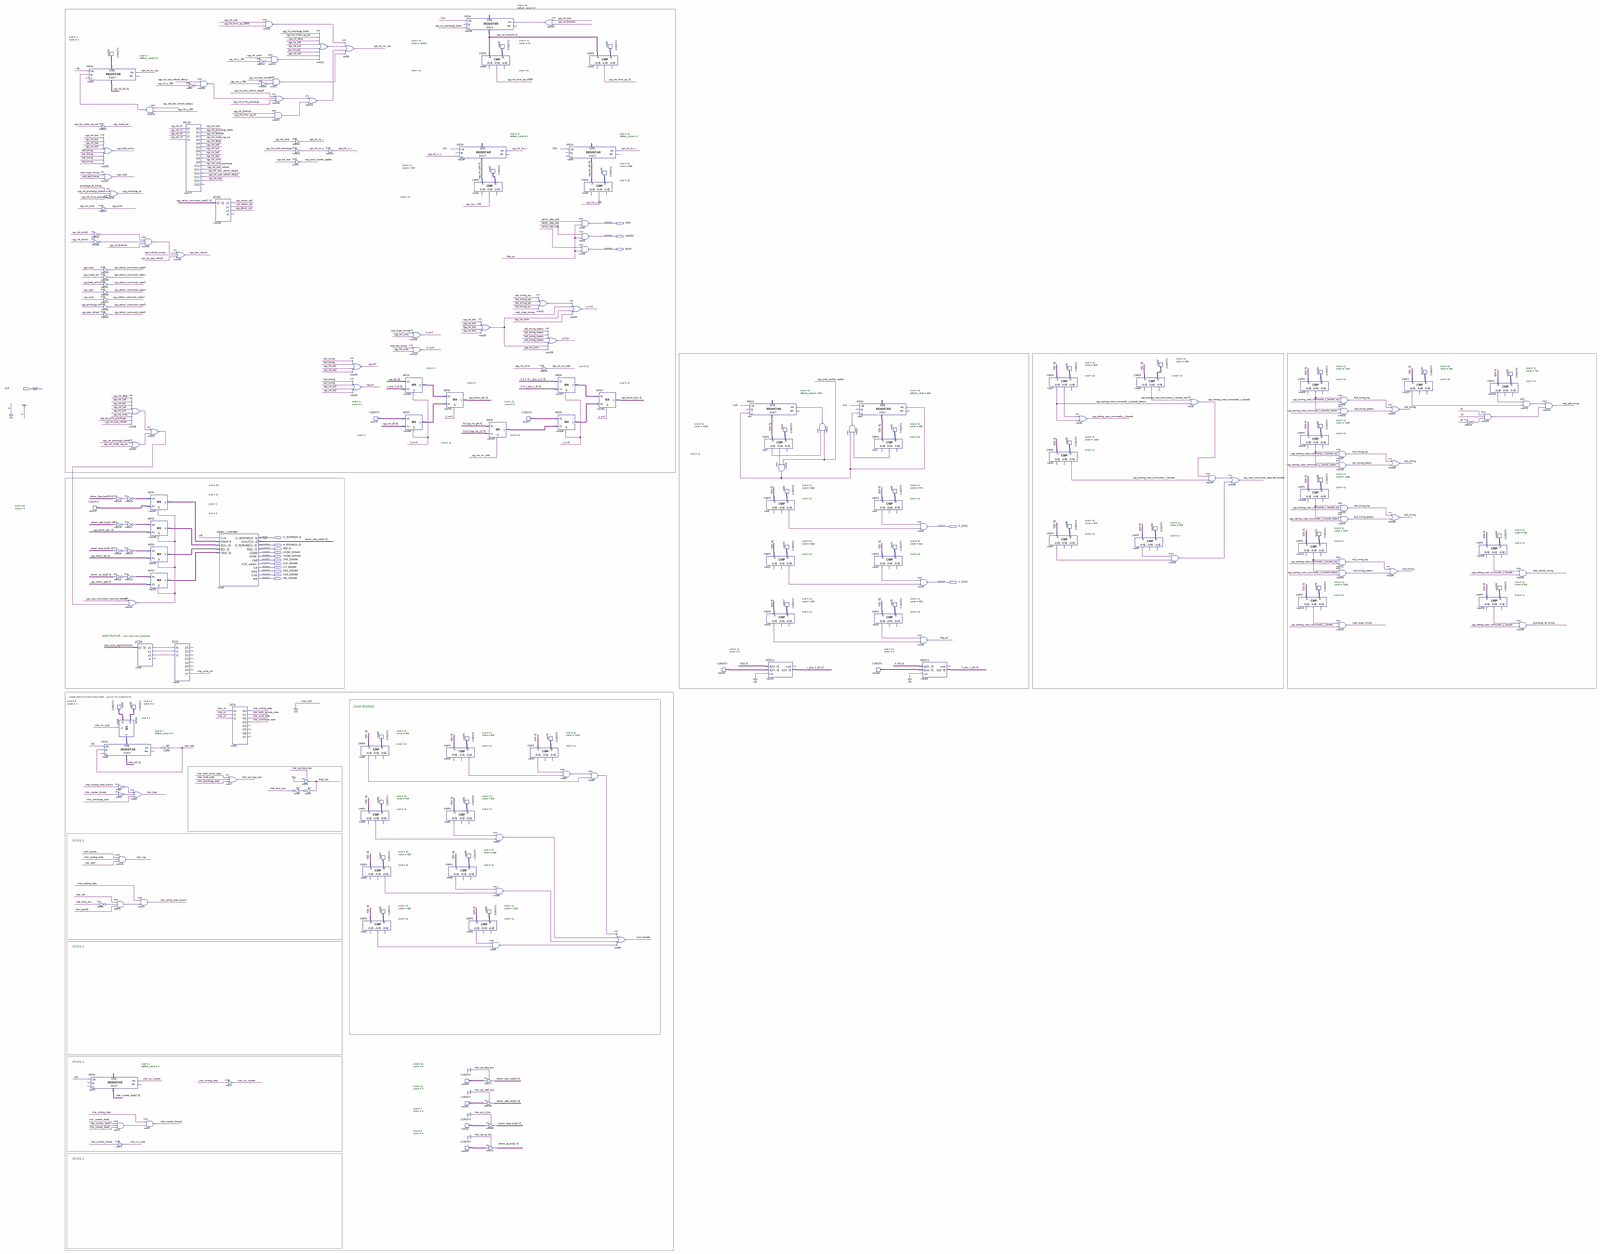
[diagram p0: schematic sheet, whole]
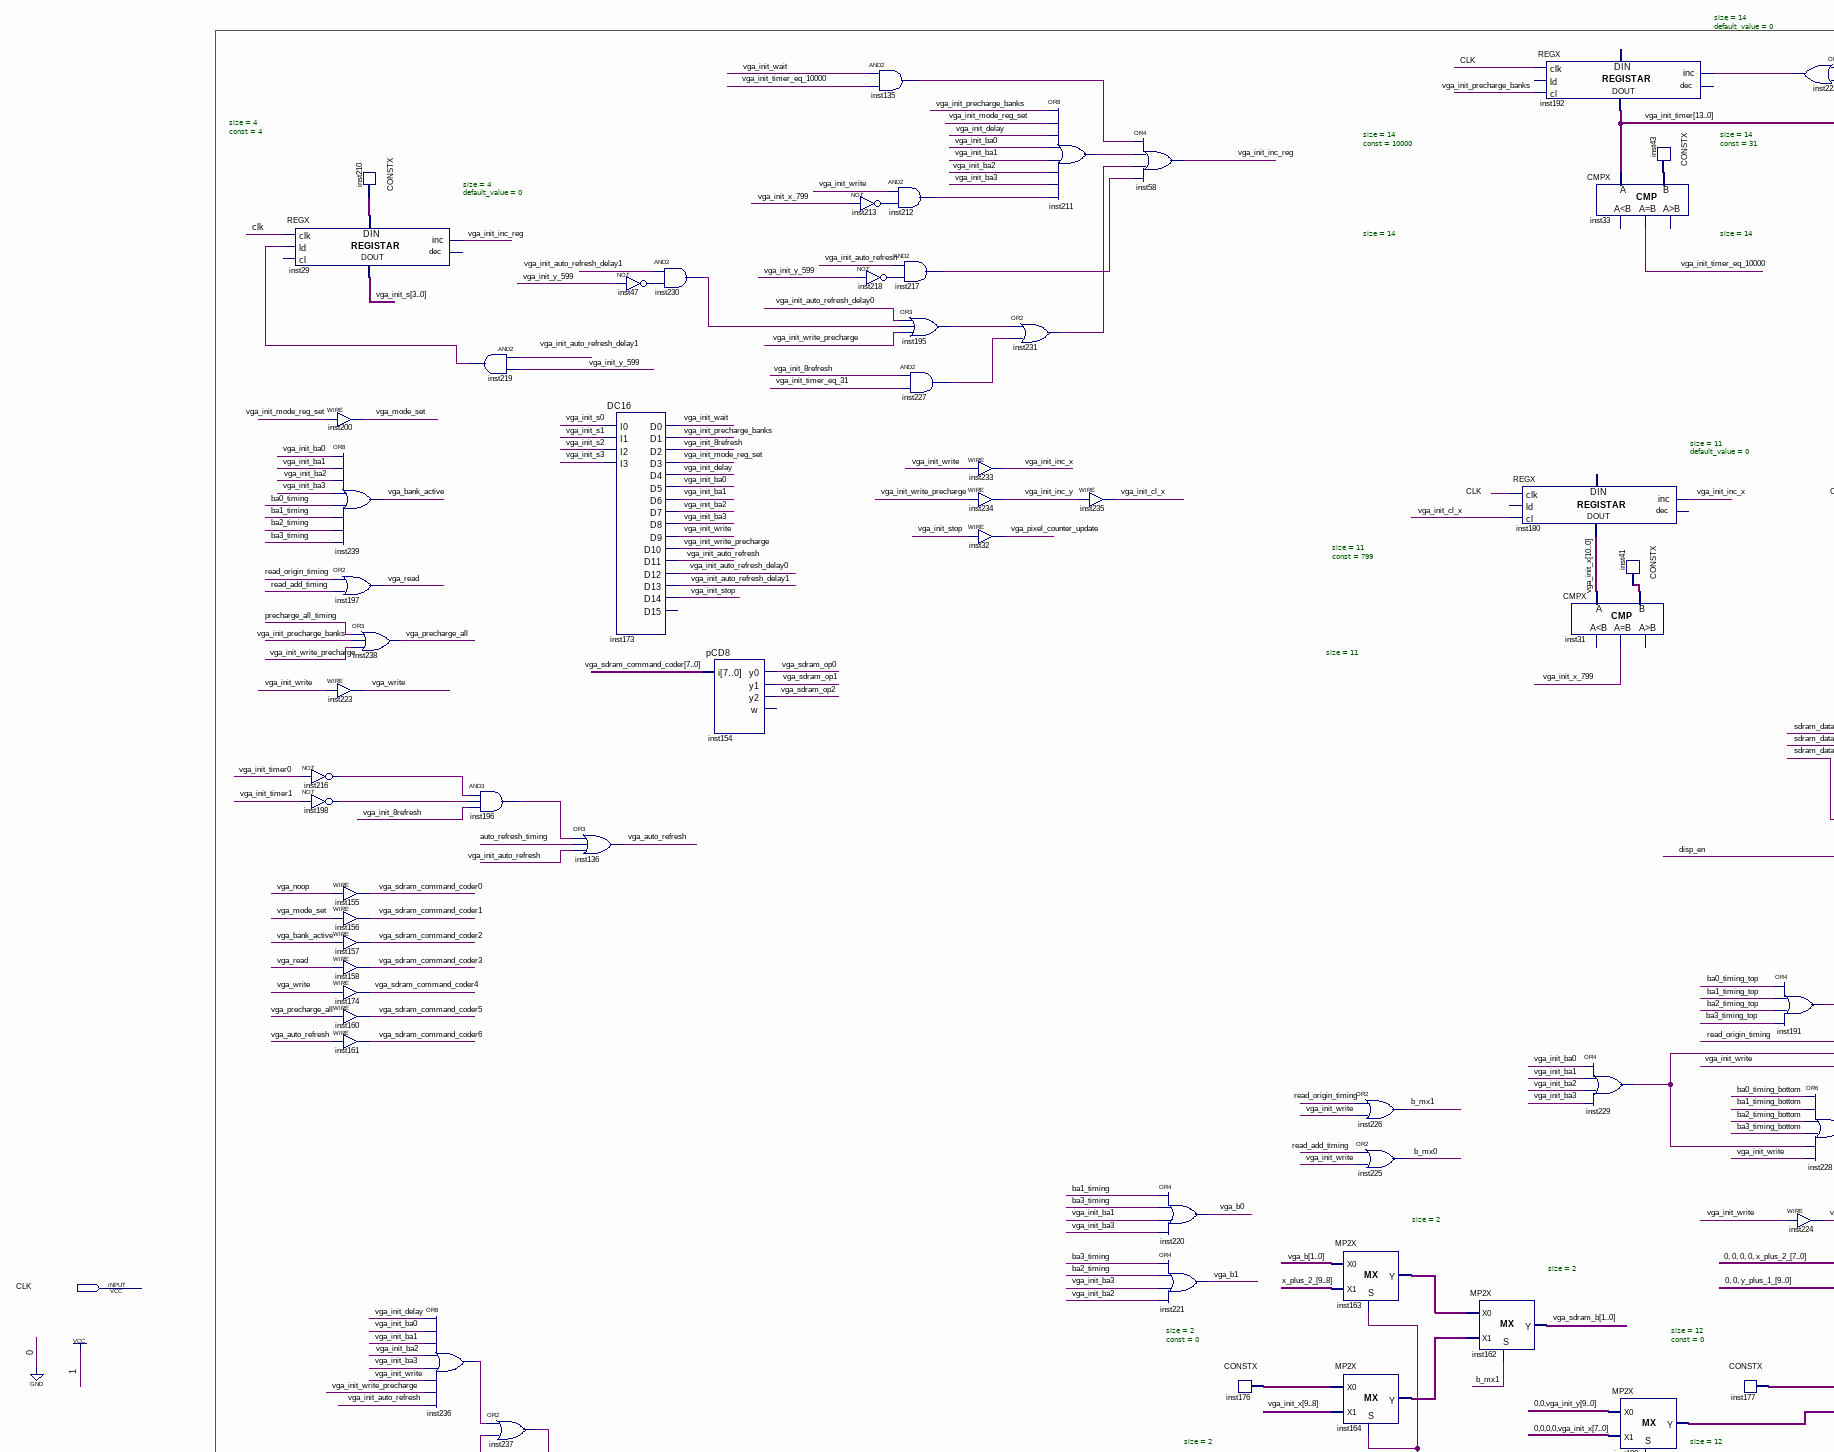
[diagram p1: schematic sheet, upper left part]
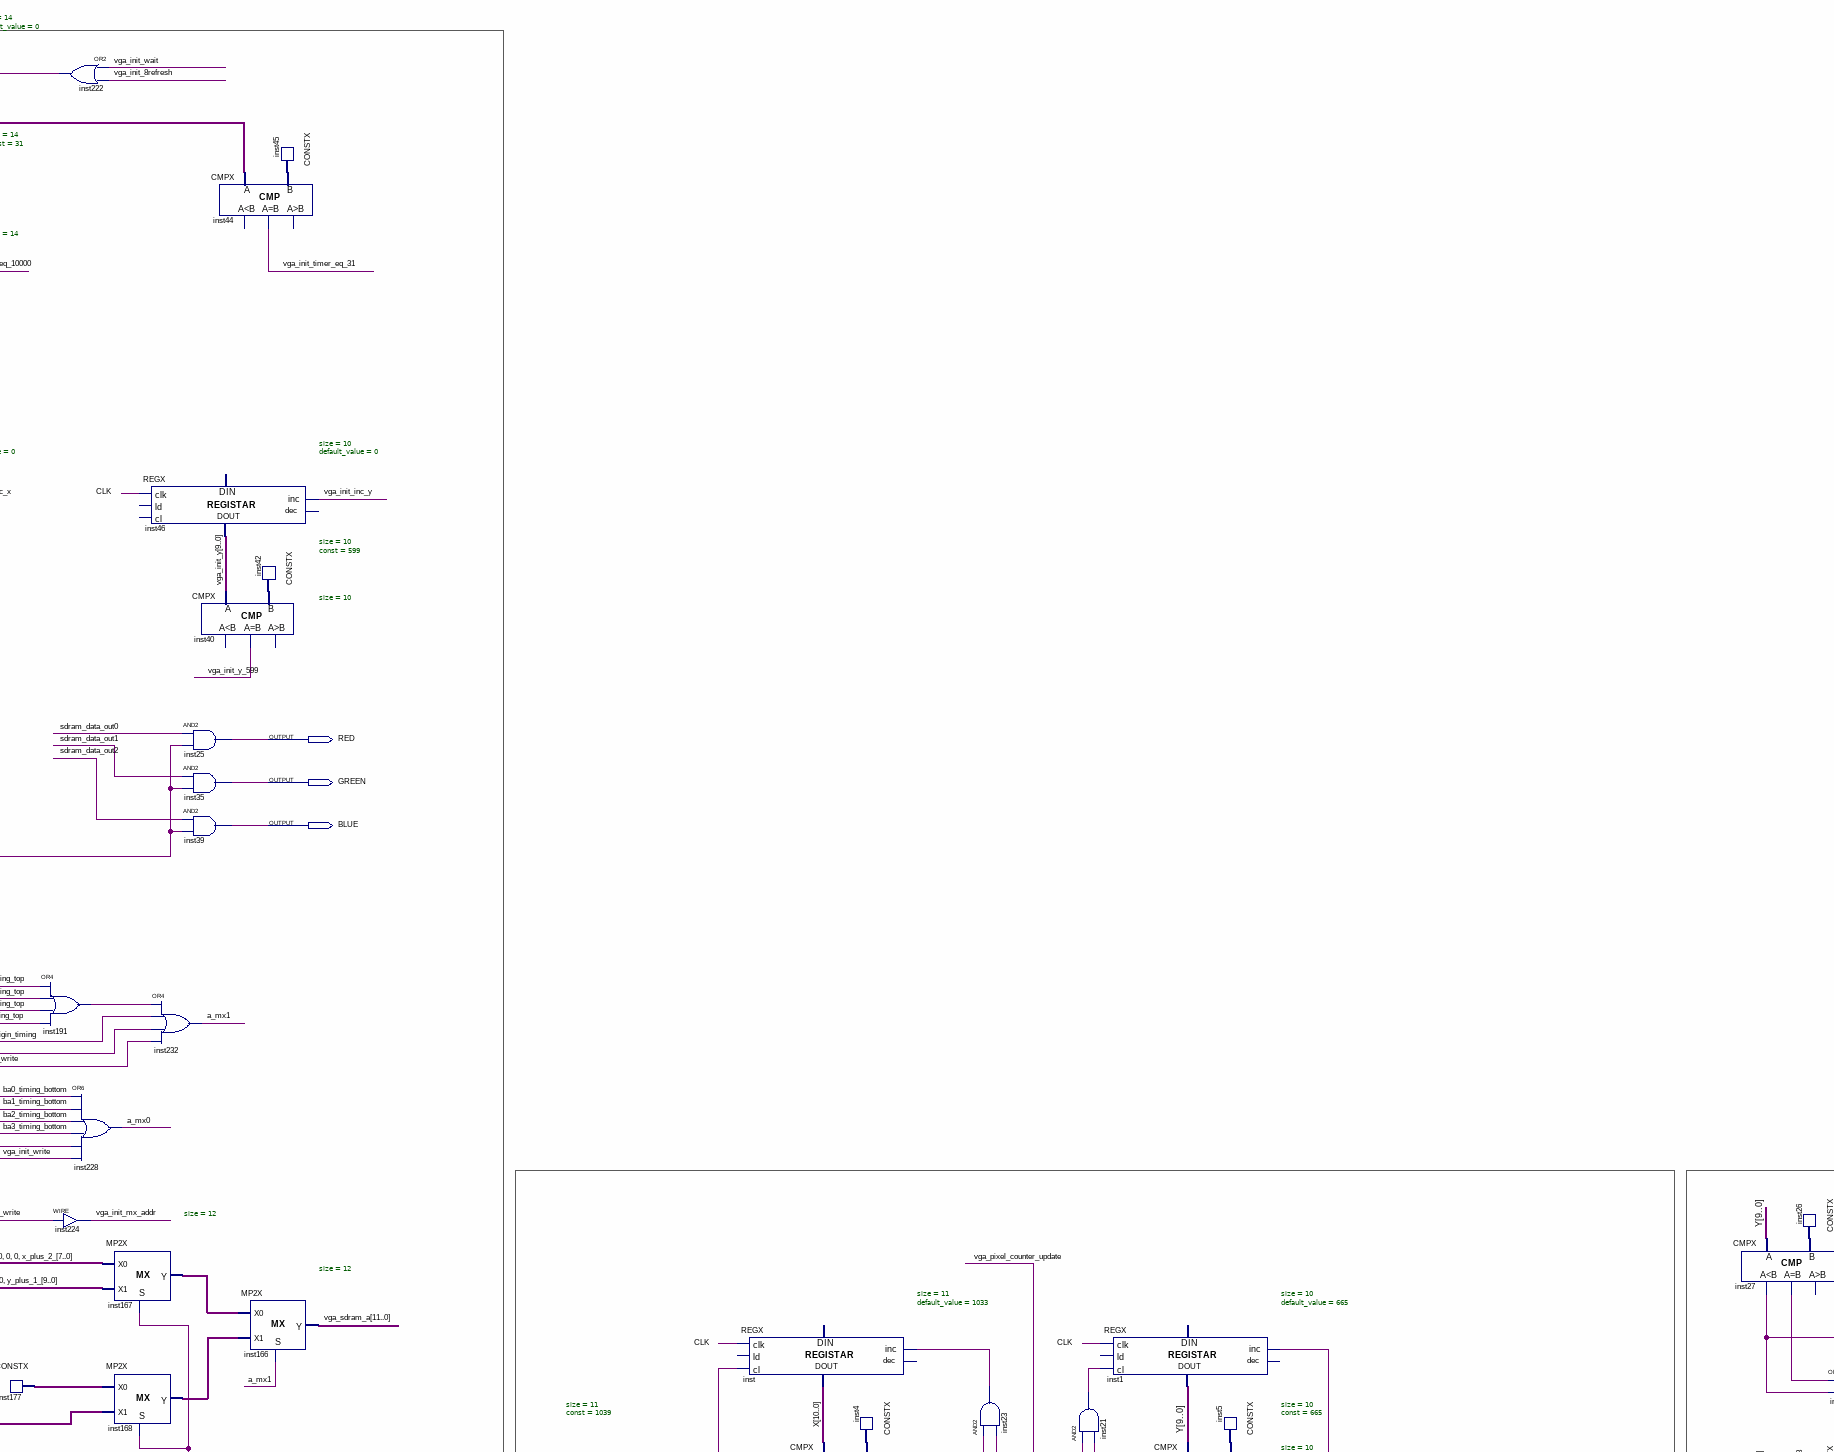
[diagram p2: schematic sheet, upper centre part]
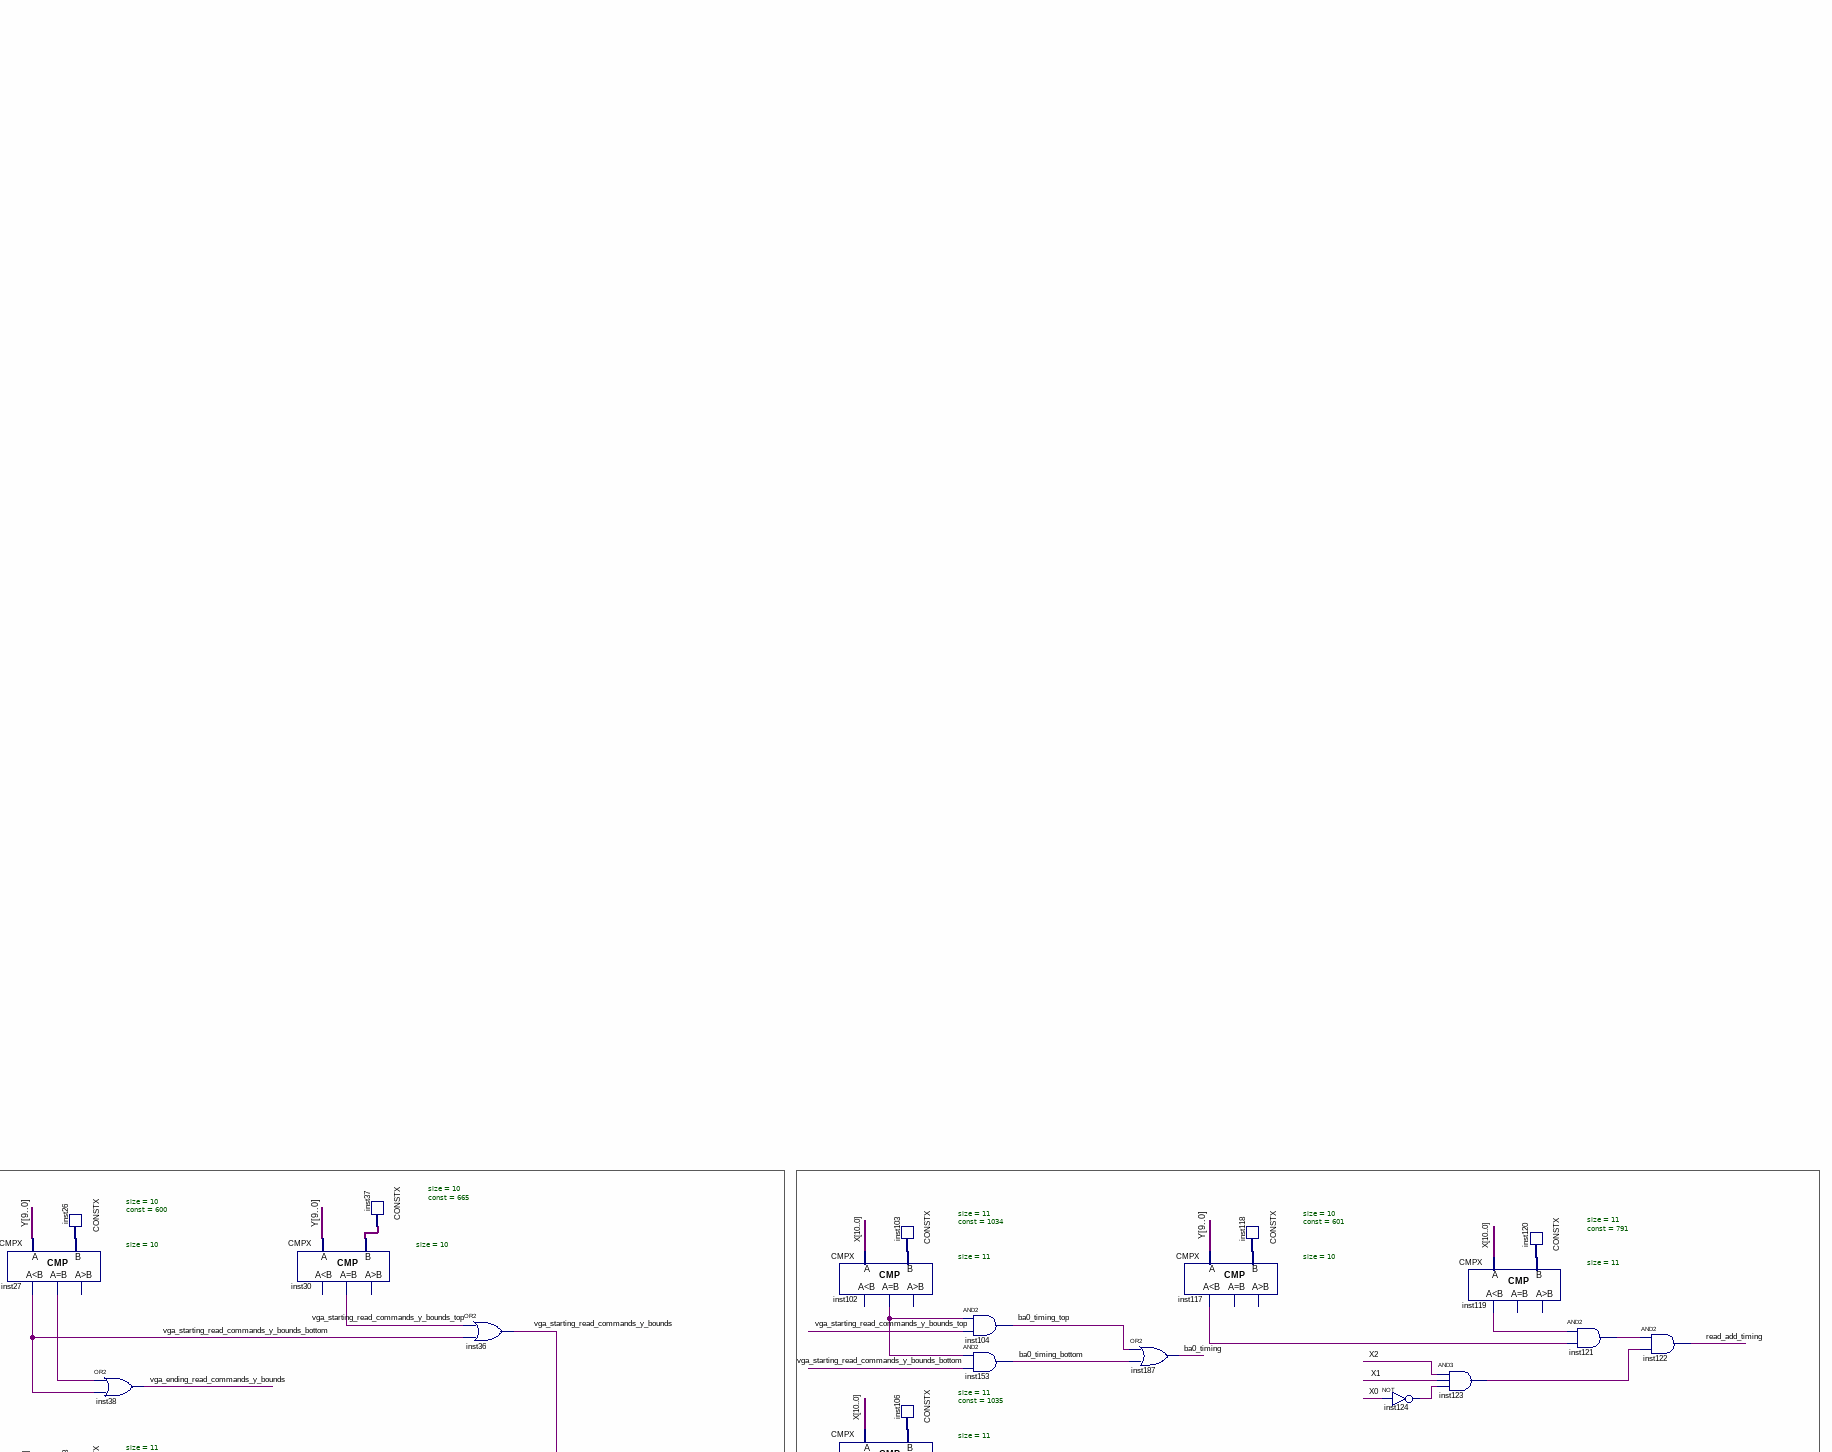
[diagram p3: schematic sheet, upper right part]
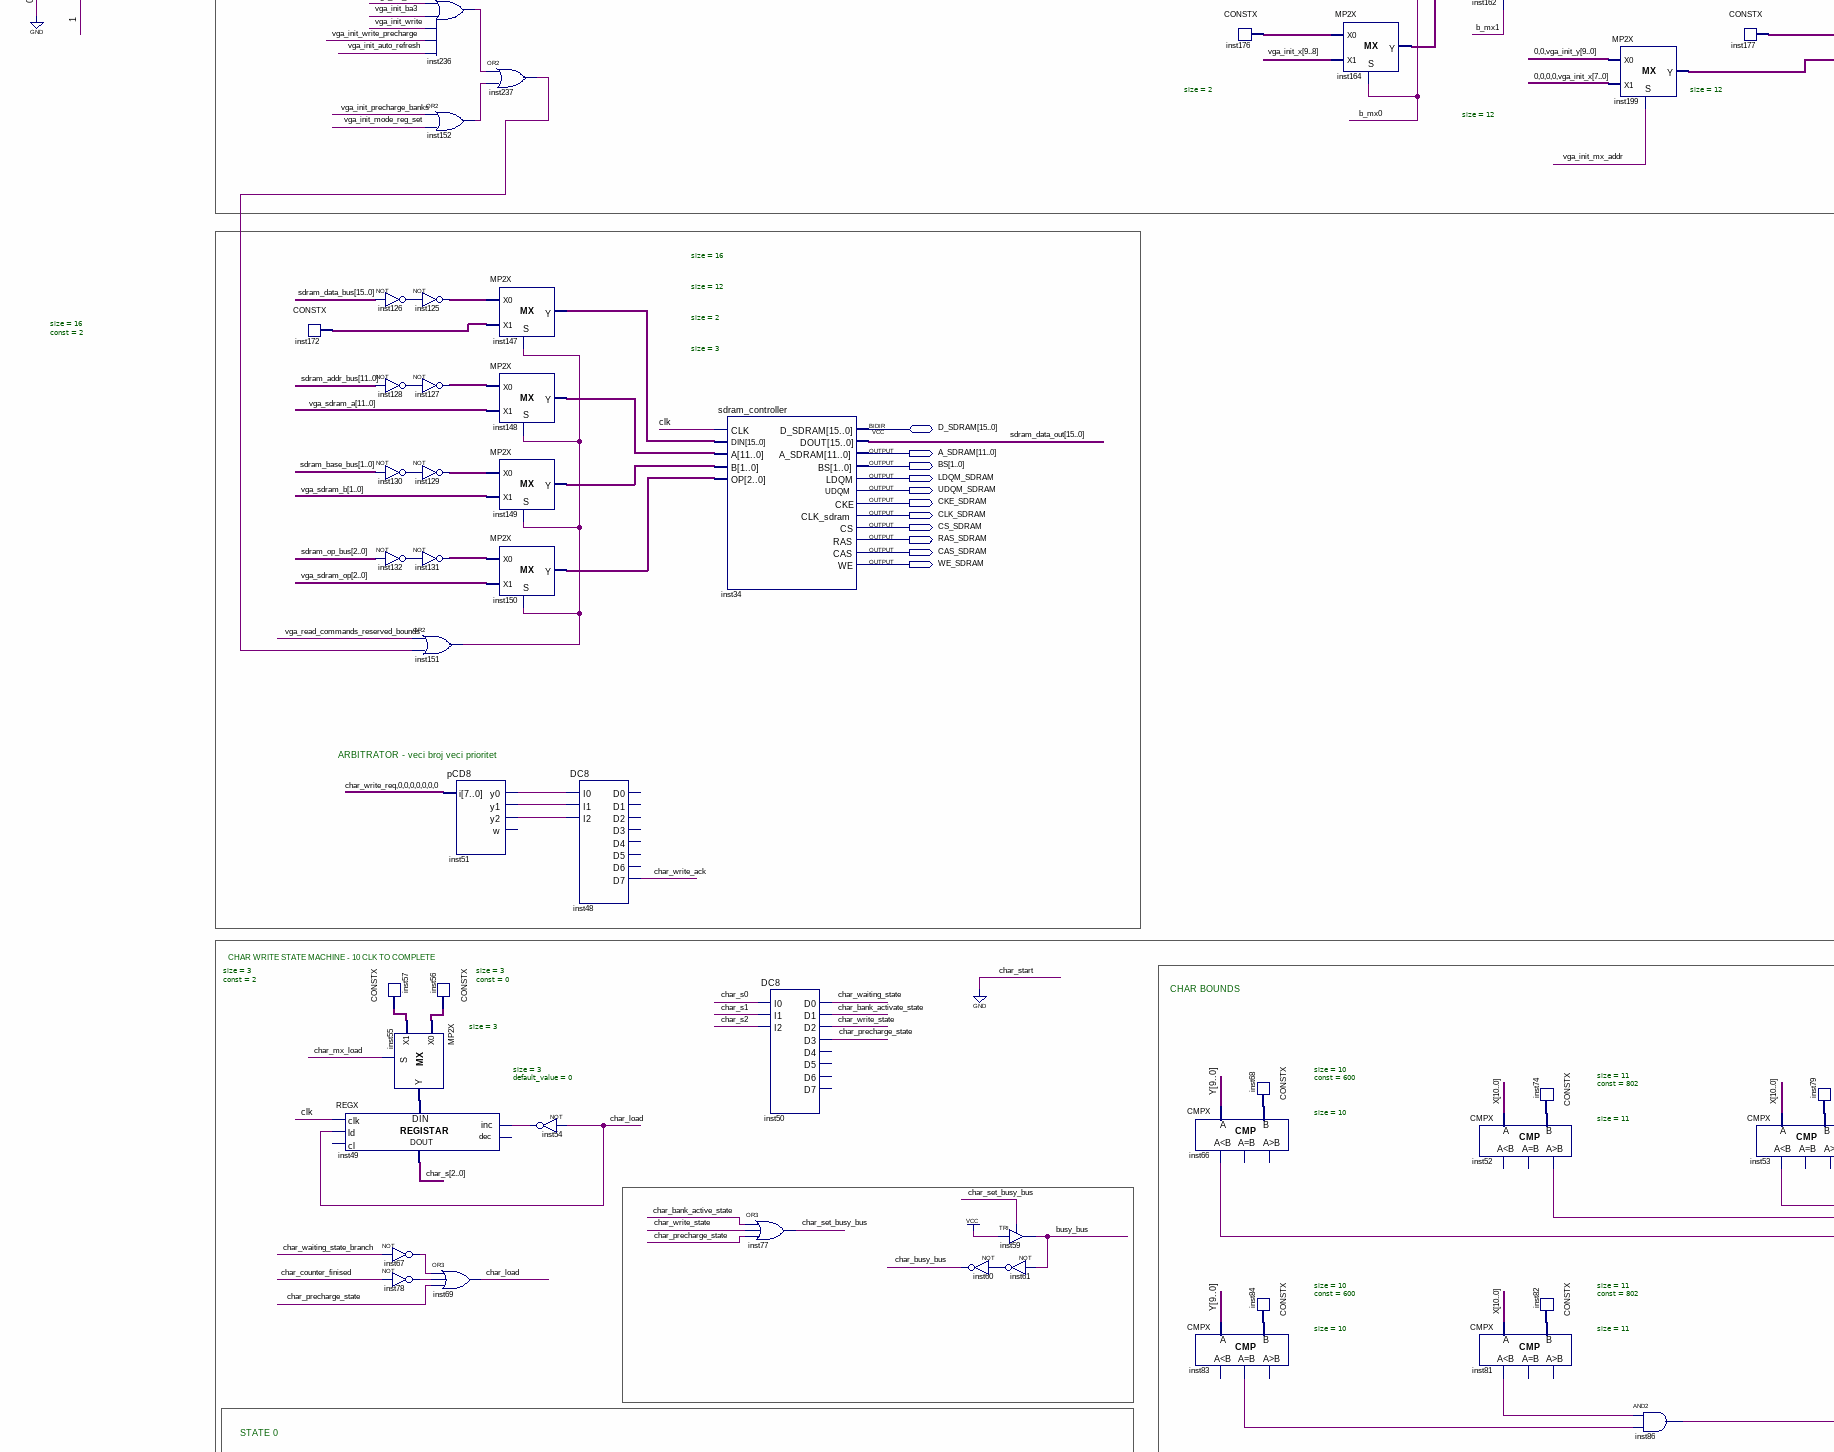
[diagram p4: schematic sheet, middle left part]
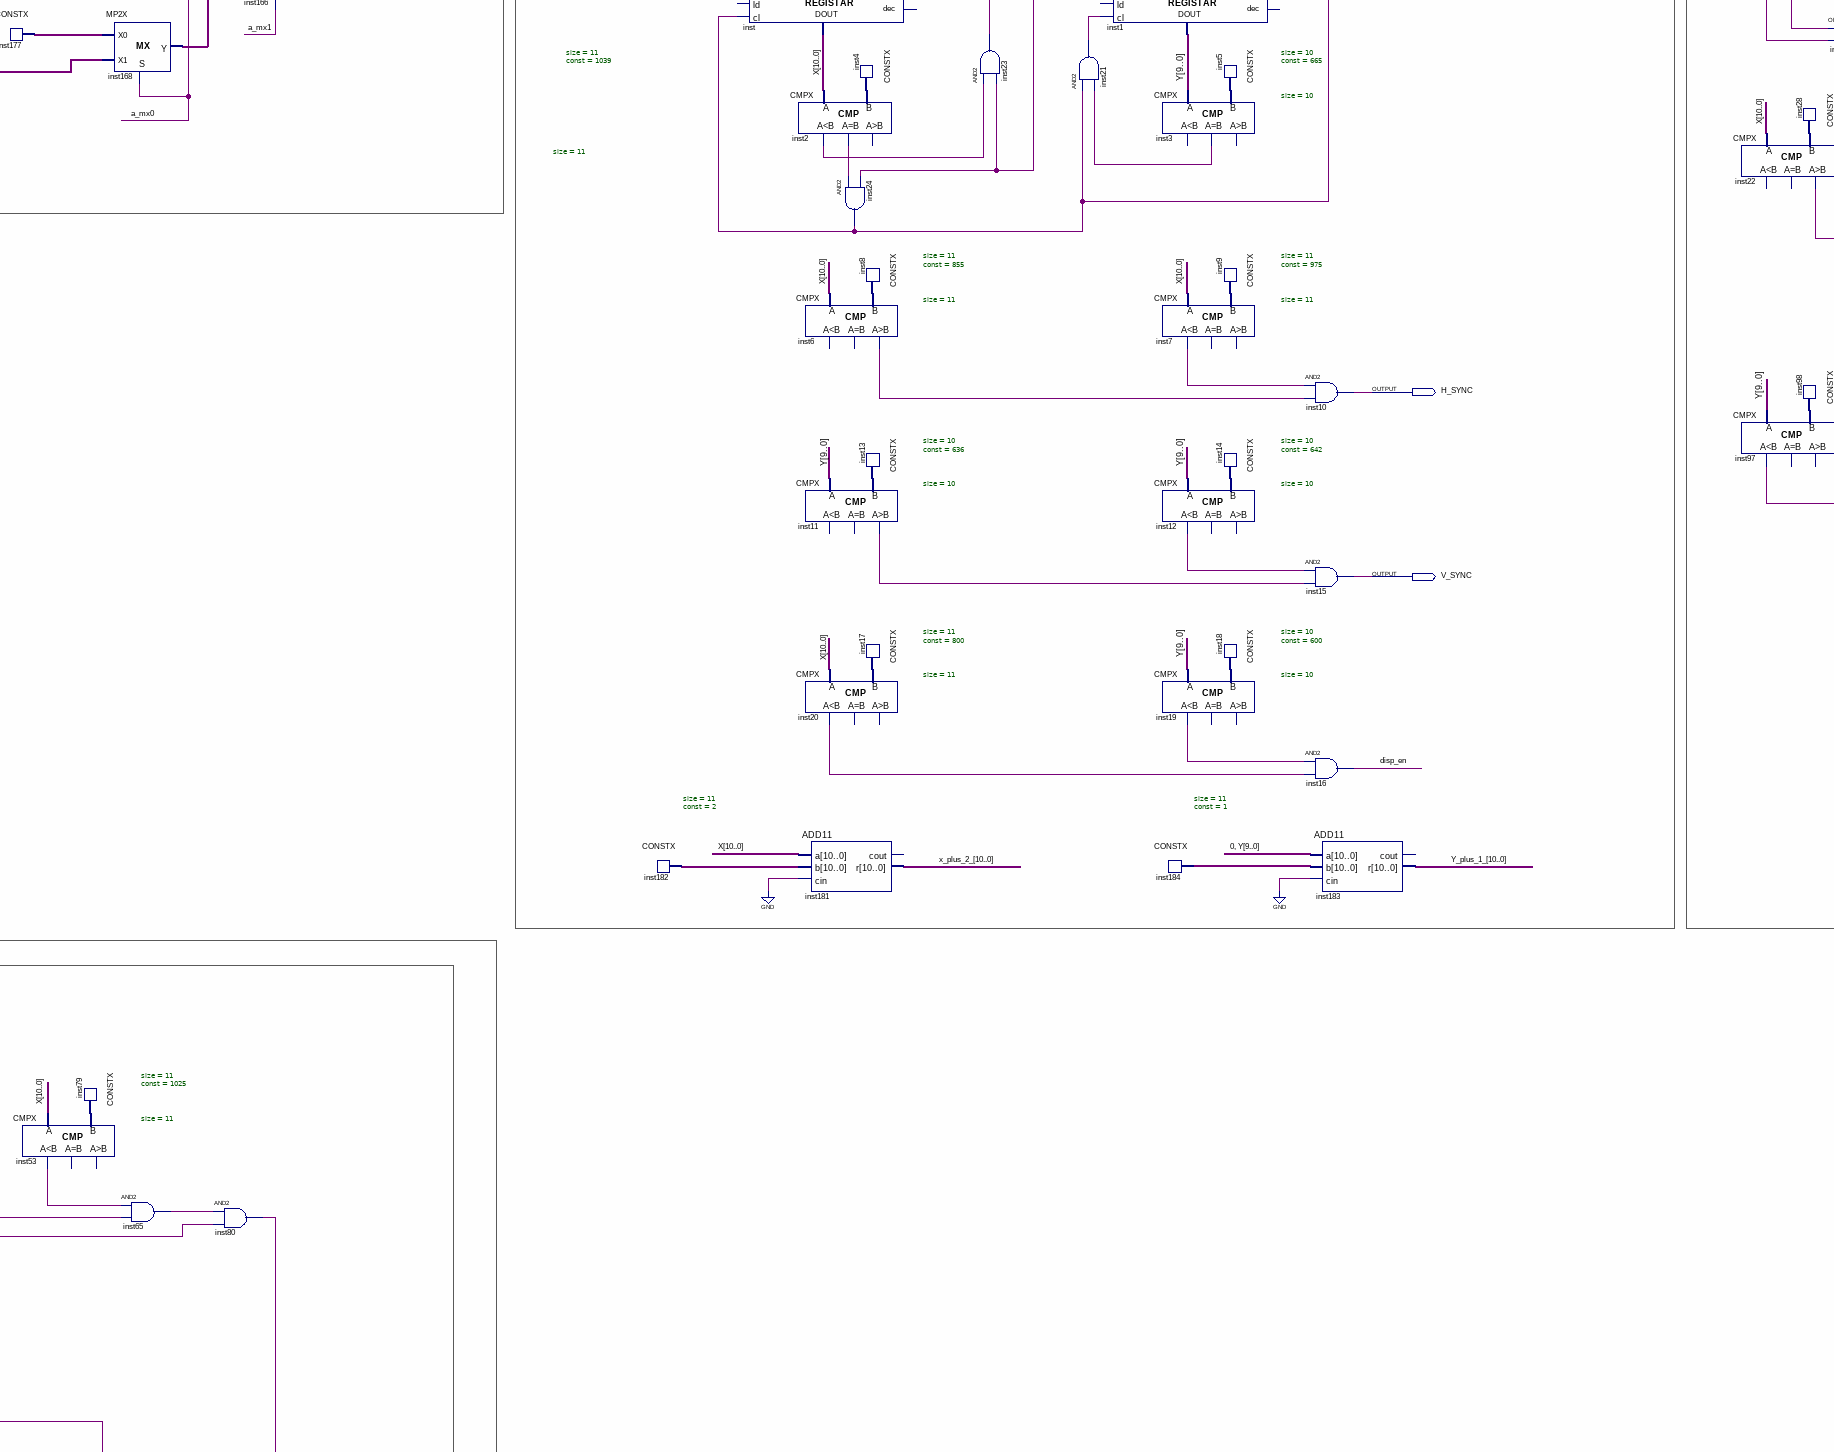
[diagram p5: schematic sheet, middle centre part]
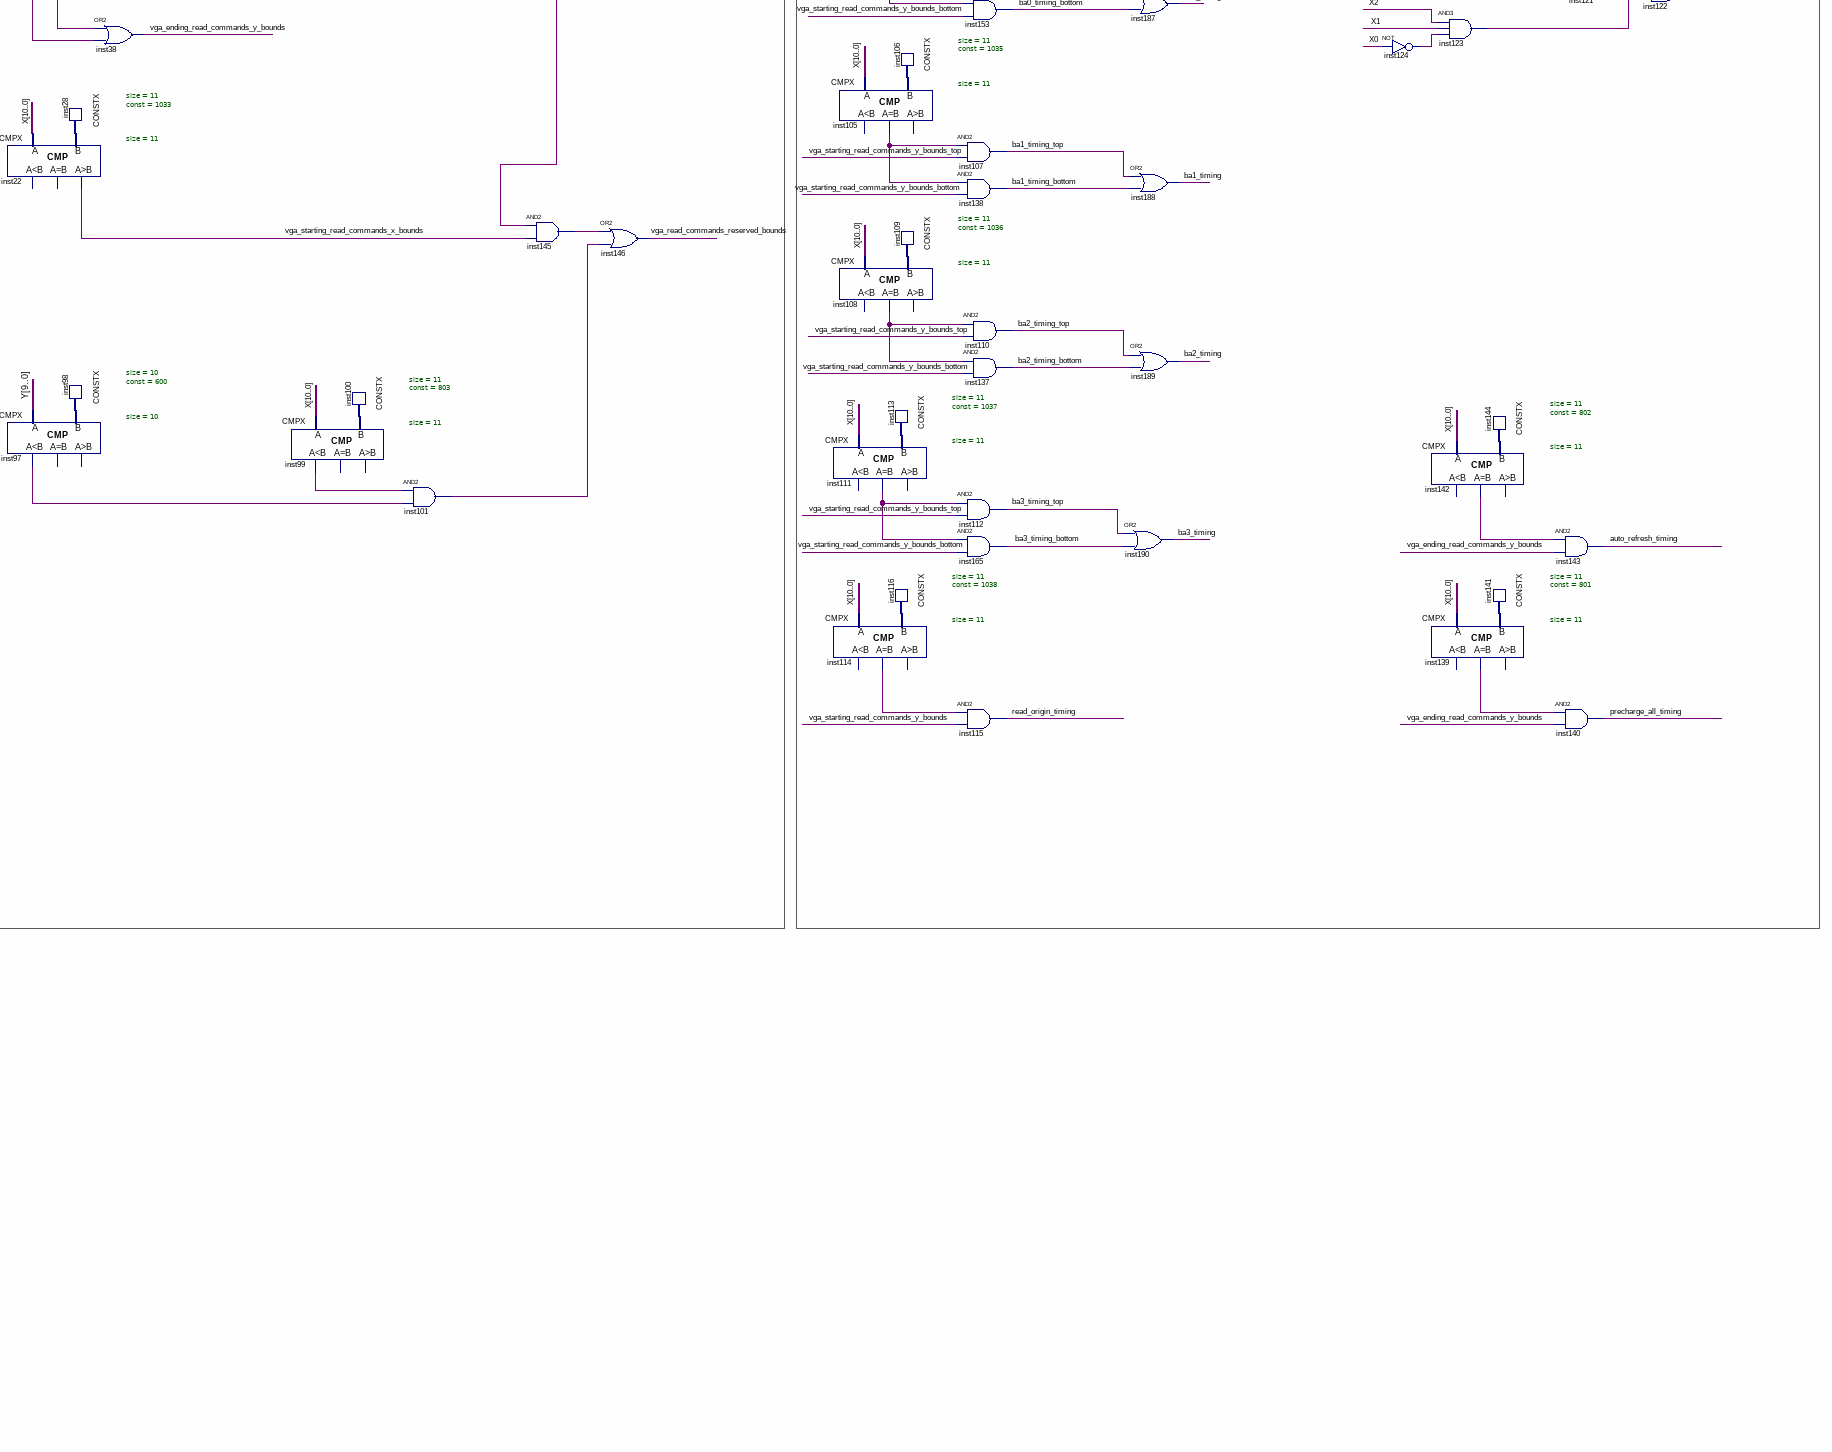
[diagram p6: schematic sheet, middle right part]
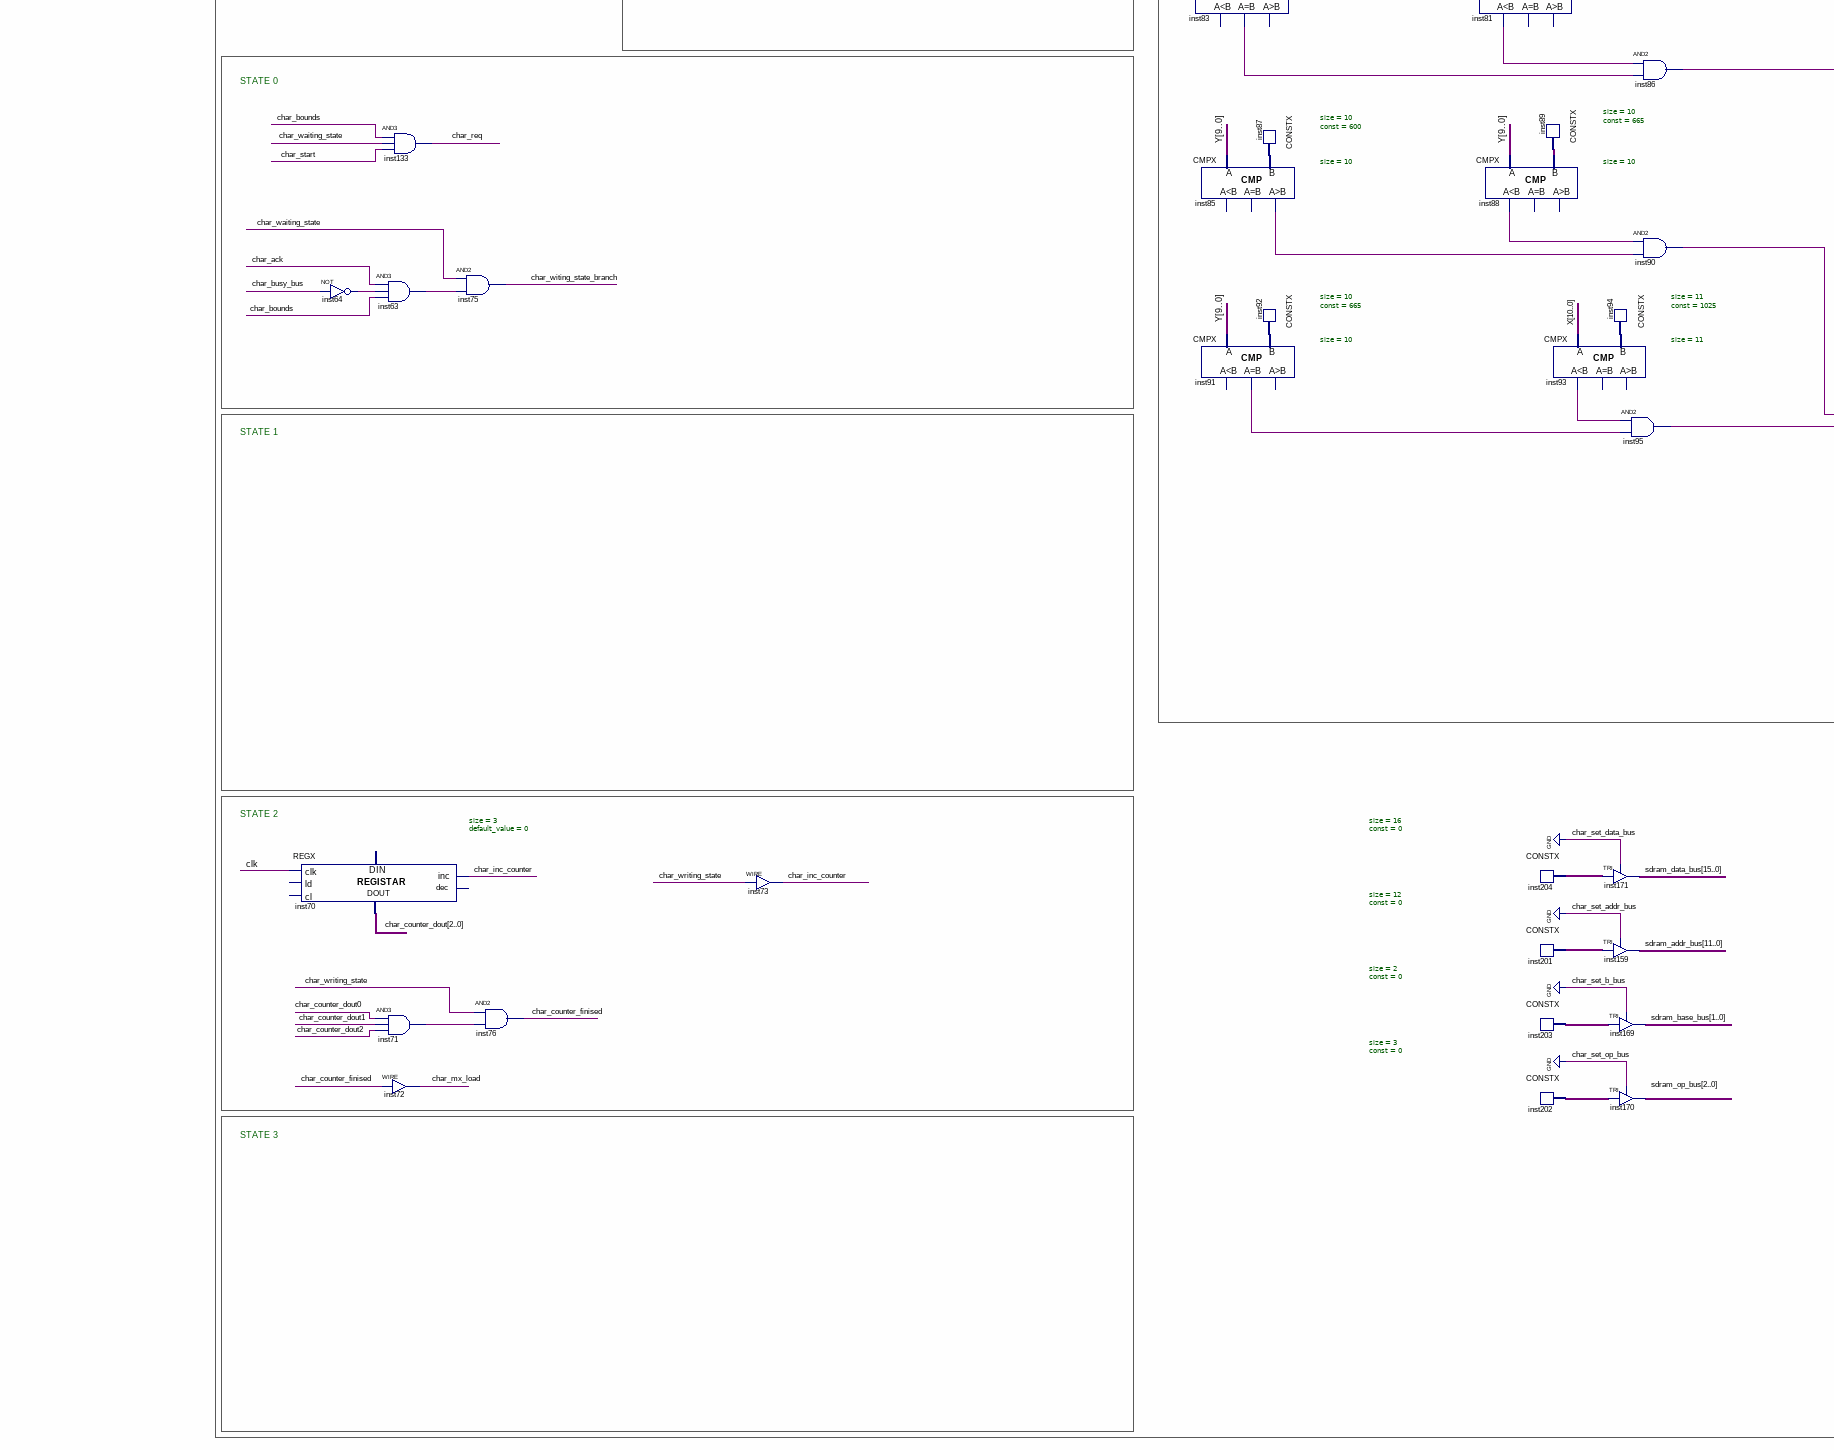
[diagram p7: schematic sheet, lower left part]
// Quartus schematic vga.bdf as structural Verilog: 224 symbols, 17 pins
module vga (
  input  CLK,
  inout  [15:0] D_SDRAM,
  output RED,
  output GREEN,
  output BLUE,
  output H_SYNC,
  output [11:0] A_SDRAM,
  output [1:0] BS,
  output LDQM_SDRAM,
  output UDQM_SDRAM,
  output CKE_SDRAM,
  output CLK_SDRAM,
  output CS_SDRAM,
  output RAS_SDRAM,
  output CAS_SDRAM,
  output WE_SDRAM,
  output V_SYNC
);

  wire a_mx0, a_mx1, auto_refresh_timing, b_mx0, b_mx1, ba0_timing, ba0_timing_bottom, ba0_timing_top,
       ba1_timing, ba1_timing_bottom, ba1_timing_top, ba2_timing, ba2_timing_bottom, ba2_timing_top,
       ba3_timing, ba3_timing_bottom, ba3_timing_top, busy_bus, char_ack, char_bank_activate_state,
       char_bank_active_state, char_bounds, char_busy_bus, char_counter_finised, char_inc_counter, char_load,
       char_mx_load, char_precharge_state, char_req, char_set_busy_bus, char_waiting_state,
       char_waiting_state_branch, char_witing_state_branch, char_write_ack, char_write_req, char_write_state,
       char_writing_state, disp_en, inst2_eq, inst2_ls, inst3_eq, inst6_gr, inst7_ls, inst11_gr, inst12_ls,
       inst19_ls, inst20_ls, inst21_out, inst23_out, inst24_out, inst27_eq, inst47_out, inst51_y0, inst51_y1,
       inst51_y2, inst52_gr, inst53_ls, inst54_out, inst61_out, inst63_out, inst64_out, inst65_out,
       inst66_ls, inst67_out, inst71_out, inst78_out, inst80_out, inst81_ls, inst83_eq, inst85_gr,
       inst86_out, inst88_ls, inst90_out, inst91_eq, inst93_ls, inst95_out, inst97_ls, inst99_ls,
       inst101_out, inst102_eq, inst105_eq, inst108_eq, inst111_eq, inst114_eq, inst117_ls, inst119_ls,
       inst121_out, inst123_out, inst124_out, inst126_out, inst128_out, inst130_out, inst132_out,
       inst135_out, inst139_eq, inst142_eq, inst145_out, inst151_out, inst152_out, inst191_out, inst195_out,
       inst196_out, inst198_out, inst211_out, inst212_out, inst213_out, inst216_out, inst217_out,
       inst218_out, inst219_out, inst222_out, inst227_out, inst229_out, inst230_out, inst231_out,
       inst236_out, inst237_out, precharge_all_timing, read_add_timing, read_origin_timing, vga_auto_refresh,
       vga_bank_active, vga_ending_read_commands_y_bounds, vga_init_8refresh, vga_init_auto_refresh,
       vga_init_auto_refresh_delay0, vga_init_auto_refresh_delay1, vga_init_ba0, vga_init_ba1, vga_init_ba2,
       vga_init_ba3, vga_init_cl_x, vga_init_delay, vga_init_inc_reg, vga_init_inc_x, vga_init_inc_y,
       vga_init_mode_reg_set, vga_init_mx_addr, vga_init_precharge_banks, vga_init_stop,
       vga_init_timer_eq_31, vga_init_timer_eq_10000, vga_init_wait, vga_init_write,
       vga_init_write_precharge, vga_init_x_799, vga_init_y_599, vga_mode_set, vga_noop,
       vga_pixel_counter_update, vga_precharge_all, vga_read, vga_read_commands_reserved_bounds,
       vga_starting_read_commands_x_bounds, vga_starting_read_commands_y_bounds,
       vga_starting_read_commands_y_bounds_bottom, vga_starting_read_commands_y_bounds_top, vga_write;
  wire [1:0] inst129_out, inst149_y, inst163_y, inst164_y, inst176_data, inst203_data, sdram_base_bus, vga_b,
       vga_sdram_b;
  wire [2:0] char_counter_dout, char_s, inst55_y, inst56_data, inst57_data, inst131_out, inst150_y,
       inst202_data, sdram_op_bus, vga_sdram_op;
  wire [3:0] inst210_data, vga_init_s;
  wire [7:0] vga_sdram_command_coder;
  wire [9:0] inst5_data, inst13_data, inst14_data, inst18_data, inst26_data, inst37_data, inst42_data,
       inst68_data, inst84_data, inst87_data, inst89_data, inst92_data, inst98_data, inst118_data,
       vga_init_y, Y;
  wire [10:0] inst4_data, inst8_data, inst9_data, inst17_data, inst28_data, inst41_data, inst74_data,
       inst79_data, inst82_data, inst94_data, inst100_data, inst103_data, inst106_data, inst109_data,
       inst113_data, inst116_data, inst120_data, inst141_data, inst144_data, inst182_data, inst184_data,
       vga_init_x, X, x_plus_2_, Y_plus_1_;
  wire [11:0] inst127_out, inst148_y, inst167_y, inst168_y, inst177_data, inst199_y, inst201_data,
       sdram_addr_bus, vga_sdram_a;
  wire [13:0] inst43_data, inst45_data, vga_init_timer;
  wire [15:0] inst125_out, inst147_y, inst172_data, inst204_data, sdram_data_bus, sdram_data_out;

  REGX #(.size(4), .default_value(0)) inst29 (
    .clk(CLK), .ld(inst219_out), .inc(vga_init_inc_reg), .data_in(inst210_data), .data_out(vga_init_s));  // open: cl, dec
  assign vga_mode_set = vga_init_mode_reg_set;  // WIRE inst200
  assign vga_write = vga_init_write;  // WIRE inst223
  not inst216 (inst216_out, vga_init_timer[0]);
  not inst198 (inst198_out, vga_init_timer[1]);
  CONSTX #(.size(16), .\const (2)) inst172 (.data(inst172_data));
  not inst64 (inst64_out, char_busy_bus);
  REGX #(.size(3), .default_value(0)) inst70 (
    .clk(CLK), .inc(char_inc_counter), .data_out(char_counter_dout));  // open: ld, cl, dec, data_in
  CONSTX #(.size(4), .\const (4)) inst210 (.data(inst210_data));
  or inst239 (vga_bank_active, vga_init_ba0, vga_init_ba1, vga_init_ba2, vga_init_ba3, ba0_timing, ba1_timing, ba2_timing, ba3_timing);
  or inst197 (vga_read, read_origin_timing, read_add_timing);
  or inst238 (vga_precharge_all, precharge_all_timing, vga_init_precharge_banks, vga_init_write_precharge);
  assign vga_sdram_command_coder[0] = vga_noop;  // WIRE inst155
  assign vga_sdram_command_coder[1] = vga_mode_set;  // WIRE inst156
  assign vga_sdram_command_coder[2] = vga_bank_active;  // WIRE inst157
  assign vga_sdram_command_coder[3] = vga_read;  // WIRE inst158
  assign vga_sdram_command_coder[4] = vga_write;  // WIRE inst174
  assign vga_sdram_command_coder[5] = vga_precharge_all;  // WIRE inst160
  assign vga_sdram_command_coder[6] = vga_auto_refresh;  // WIRE inst161
  assign inst126_out = ~sdram_data_bus;  // NOT inst126, 16 bits wide
  assign inst128_out = ~sdram_addr_bus;  // NOT inst128, 12 bits wide
  assign inst130_out = ~sdram_base_bus;  // NOT inst130, 2 bits wide
  assign inst132_out = ~sdram_op_bus;  // NOT inst132, 3 bits wide
  CONSTX #(.size(3), .\const (2)) inst57 (.data(inst57_data));
  REGX #(.size(3), .default_value(0)) inst49 (
    .clk(CLK), .ld(char_load), .inc(inst54_out), .data_in(inst55_y), .data_out(char_s));  // open: cl, dec
  and inst63 (inst63_out, char_ack, inst64_out, char_bounds);
  and inst71 (inst71_out, char_counter_dout[0], char_counter_dout[1], char_counter_dout[2]);
  or inst236 (inst236_out, vga_init_delay, vga_init_ba0, vga_init_ba1, vga_init_ba2, vga_init_ba3, vga_init_write, vga_init_write_precharge, vga_init_auto_refresh);
  or inst152 (inst152_out, vga_init_precharge_banks, vga_init_mode_reg_set);
  assign inst125_out = ~{16{inst126_out}};  // NOT inst125, 16 bits wide
  assign inst127_out = ~{12{inst128_out}};  // NOT inst127, 12 bits wide
  assign inst129_out = ~{2{inst130_out}};  // NOT inst129, 2 bits wide
  assign inst131_out = ~{3{inst132_out}};  // NOT inst131, 3 bits wide
  or inst151 (inst151_out, vga_read_commands_reserved_bounds, inst237_out);
  CONSTX #(.size(3), .\const (0)) inst56 (.data(inst56_data));
  MP2X #(.size(3)) inst55 (.S(char_mx_load), .X0(inst56_data), .X1(inst57_data), .Y(inst55_y));
  not inst67 (inst67_out, char_waiting_state_branch);
  not inst78 (inst78_out, char_counter_finised);
  and inst133 (char_req, char_bounds, char_waiting_state, 1'b0);
  assign char_mx_load = char_counter_finised;  // WIRE inst72
  and inst219 (inst219_out, vga_init_auto_refresh_delay1, vga_init_y_599);
  and inst196 (inst196_out, inst216_out, inst198_out, vga_init_8refresh);
  pCD8 inst51 (.i({char_write_req, {7{1'b0}}}), .y0(inst51_y0), .y1(inst51_y1), .y2(inst51_y2));  // open: w
  or inst69 (char_load, inst67_out, inst78_out, char_precharge_state);
  and inst75 (char_witing_state_branch, char_waiting_state, inst63_out);
  and inst76 (char_counter_finised, char_writing_state, inst71_out);
  or inst237 (inst237_out, inst236_out, inst152_out);
  MP2X #(.size(16)) inst147 (.S(inst151_out), .X0(inst125_out), .X1(inst172_data), .Y(inst147_y));
  MP2X #(.size(12)) inst148 (.S(inst151_out), .X0(inst127_out), .X1(vga_sdram_a), .Y(inst148_y));
  MP2X #(.size(2)) inst149 (.S(inst151_out), .X0(inst129_out), .X1(vga_sdram_b), .Y(inst149_y));
  MP2X #(.size(3)) inst150 (.S(inst151_out), .X0(inst131_out), .X1(vga_sdram_op), .Y(inst150_y));
  or inst136 (vga_auto_refresh, inst196_out, auto_refresh_timing, vga_init_auto_refresh);
  DC8 inst48 (.I0(inst51_y0), .I1(inst51_y1), .I2(inst51_y2), .D7(char_write_ack));  // open: D0, D1, D2, D3, D4, D5, D6
  not inst54 (inst54_out, char_load);
  not inst47 (inst47_out, vga_init_y_599);
  DC16 inst173 (
    .I0(vga_init_s[0]), .I1(vga_init_s[1]), .I2(vga_init_s[2]), .I3(vga_init_s[3]), .D0(vga_init_wait),
    .D1(vga_init_precharge_banks), .D2(vga_init_8refresh), .D3(vga_init_mode_reg_set), .D4(vga_init_delay),
    .D5(vga_init_ba0), .D6(vga_init_ba1), .D7(vga_init_ba2), .D8(vga_init_ba3), .D9(vga_init_write),
    .D10(vga_init_write_precharge), .D11(vga_init_auto_refresh), .D12(vga_init_auto_refresh_delay0),
    .D13(vga_init_auto_refresh_delay1), .D14(vga_init_stop));  // open: D15
  and inst230 (inst230_out, vga_init_auto_refresh_delay1, inst47_out);
  pCD8 inst154 (
    .i(vga_sdram_command_coder), .y0(vga_sdram_op[0]), .y1(vga_sdram_op[1]), .y2(vga_sdram_op[2]));  // open: w
  sdram_controller inst34 (
    .CLK(CLK), .DIN(inst147_y), .A(inst148_y), .B(inst149_y), .OP(inst150_y), .DOUT(sdram_data_out),
    .A_SDRAM(A_SDRAM), .BS(BS), .LDQM(LDQM_SDRAM), .UDQM(UDQM_SDRAM), .CKE(CKE_SDRAM), .CLK_sdram(CLK_SDRAM),
    .CS(CS_SDRAM), .RAS(RAS_SDRAM), .CAS(CAS_SDRAM), .WE(WE_SDRAM), .D_SDRAM(D_SDRAM));
  DC8 inst50 (
    .I0(char_s[0]), .I1(char_s[1]), .I2(char_s[2]), .D0(char_waiting_state), .D1(char_bank_activate_state),
    .D2(char_write_state), .D3(char_precharge_state));  // open: D4, D5, D6, D7
  or inst77 (char_set_busy_bus, char_bank_active_state, char_write_state, char_precharge_state);
  assign char_inc_counter = char_writing_state;  // WIRE inst73
  and inst135 (inst135_out, vga_init_wait, vga_init_timer_eq_10000);
  not inst213 (inst213_out, vga_init_x_799);
  not inst218 (inst218_out, vga_init_y_599);
  and inst212 (inst212_out, vga_init_write, inst213_out);
  and inst217 (inst217_out, vga_init_auto_refresh, inst218_out);
  or inst195 (inst195_out, vga_init_auto_refresh_delay0, inst230_out, vga_init_write_precharge);
  and inst227 (inst227_out, vga_init_8refresh, vga_init_timer_eq_31);
  assign vga_init_inc_x = vga_init_write;  // WIRE inst233
  assign vga_init_inc_y = vga_init_write_precharge;  // WIRE inst234
  assign vga_pixel_counter_update = vga_init_stop;  // WIRE inst32
  not inst60 (char_busy_bus, inst61_out);
  or inst231 (inst231_out, inst195_out, inst227_out);
  TRI inst59 (.IN(1'b1), .OE(char_set_busy_bus), .OUT(busy_bus));
  not inst61 (inst61_out, busy_bus);
  or inst211 (inst211_out, vga_init_precharge_banks, vga_init_mode_reg_set, vga_init_delay, vga_init_ba0, vga_init_ba1, vga_init_ba2, vga_init_ba3, inst212_out);
  assign vga_init_cl_x = vga_init_inc_y;  // WIRE inst235
  or inst58 (vga_init_inc_reg, inst135_out, inst211_out, inst231_out, inst217_out);
  or inst220 (vga_b[0], ba1_timing, ba3_timing, vga_init_ba1, vga_init_ba3);
  or inst221 (vga_b[1], ba3_timing, ba2_timing, vga_init_ba3, vga_init_ba2);
  CMPX #(.size(10)) inst66 (.A(Y), .B(inst68_data), .ls(inst66_ls));  // open: eq, gr
  CMPX #(.size(10)) inst83 (.A(Y), .B(inst84_data), .eq(inst83_eq));  // open: ls, gr
  CMPX #(.size(10)) inst85 (.A(Y), .B(inst87_data), .gr(inst85_gr));  // open: ls, eq
  CMPX #(.size(10)) inst91 (.A(Y), .B(inst92_data), .eq(inst91_eq));  // open: ls, gr
  CONSTX #(.size(2), .\const (0)) inst176 (.data(inst176_data));
  CONSTX #(.size(10), .\const (600)) inst68 (.data(inst68_data));
  CONSTX #(.size(10), .\const (600)) inst84 (.data(inst84_data));
  CONSTX #(.size(10), .\const (600)) inst87 (.data(inst87_data));
  CONSTX #(.size(10), .\const (665)) inst92 (.data(inst92_data));
  or inst226 (b_mx1, read_origin_timing, vga_init_write);
  or inst225 (b_mx0, read_add_timing, vga_init_write);
  MP2X #(.size(2)) inst163 (.S(b_mx0), .X0(vga_b), .X1(x_plus_2_[9:8]), .Y(inst163_y));
  MP2X #(.size(2)) inst164 (.S(b_mx0), .X0(inst176_data), .X1(vga_init_x[9:8]), .Y(inst164_y));
  REGX #(.size(11), .default_value(0)) inst180 (
    .clk(CLK), .cl(vga_init_cl_x), .inc(vga_init_inc_x), .data_out(vga_init_x));  // open: ld, dec, data_in
  MP2X #(.size(2)) inst162 (.S(b_mx1), .X0(inst163_y), .X1(inst164_y), .Y(vga_sdram_b));
  CMPX #(.size(11)) inst52 (.A(X), .B(inst74_data), .gr(inst52_gr));  // open: ls, eq
  CMPX #(.size(11)) inst81 (.A(X), .B(inst82_data), .ls(inst81_ls));  // open: eq, gr
  CMPX #(.size(10)) inst88 (.A(Y), .B(inst89_data), .ls(inst88_ls));  // open: eq, gr
  REGX #(.size(14), .default_value(0)) inst192 (
    .clk(CLK), .cl(vga_init_precharge_banks), .inc(inst222_out), .data_out(vga_init_timer));  // open: ld, dec, data_in
  CMPX #(.size(11)) inst31 (.A(vga_init_x), .B(inst41_data), .eq(vga_init_x_799));  // open: ls, gr
  CONSTX #(.size(11), .\const (802)) inst74 (.data(inst74_data));
  CONSTX #(.size(11), .\const (802)) inst82 (.data(inst82_data));
  CONSTX #(.size(10), .\const (665)) inst89 (.data(inst89_data));
  CMPX #(.size(11)) inst93 (.A(X), .B(inst94_data), .ls(inst93_ls));  // open: eq, gr
  CONSTX #(.size(16), .\const (0)) inst204 (.data(inst204_data));
  CONSTX #(.size(12), .\const (0)) inst201 (.data(inst201_data));
  CONSTX #(.size(2), .\const (0)) inst203 (.data(inst203_data));
  CONSTX #(.size(3), .\const (0)) inst202 (.data(inst202_data));
  CMPX #(.size(14)) inst33 (.A(vga_init_timer), .B(inst43_data), .eq(vga_init_timer_eq_10000));  // open: ls, gr
  or inst229 (inst229_out, vga_init_ba0, vga_init_ba1, vga_init_ba2, vga_init_ba3);
  MP2X #(.size(12)) inst199 (
    .S(vga_init_mx_addr), .X0({2'b00, vga_init_y}), .X1({4'b0000, vga_init_x[7:0]}), .Y(inst199_y));
  CONSTX #(.size(11), .\const (1025)) inst94 (.data(inst94_data));
  TRI inst171[15:0] (.IN(inst204_data), .OE(1'b0), .OUT(sdram_data_bus));
  TRI inst159[11:0] (.IN(inst201_data), .OE(1'b0), .OUT(sdram_addr_bus));
  TRI inst169[1:0] (.IN(inst203_data), .OE(1'b0), .OUT(sdram_base_bus));
  TRI inst170[2:0] (.IN(inst202_data), .OE(1'b0), .OUT(sdram_op_bus));
  CONSTX #(.size(14), .\const (10000)) inst43 (.data(inst43_data));
  CONSTX #(.size(11), .\const (799)) inst41 (.data(inst41_data));
  and inst86 (inst86_out, inst81_ls, inst83_eq);
  and inst90 (inst90_out, inst88_ls, inst85_gr);
  and inst95 (inst95_out, inst93_ls, inst91_eq);
  CONSTX #(.size(12), .\const (0)) inst177 (.data(inst177_data));
  CMPX #(.size(11)) inst53 (.A(X), .B(inst79_data), .ls(inst53_ls));  // open: eq, gr
  or inst222 (inst222_out, vga_init_wait, vga_init_8refresh);
  or inst191 (inst191_out, ba0_timing_top, ba1_timing_top, ba2_timing_top, ba3_timing_top);
  or inst228 (a_mx0, ba0_timing_bottom, ba1_timing_bottom, ba2_timing_bottom, ba3_timing_bottom, inst229_out, vga_init_write);
  assign vga_init_mx_addr = vga_init_write;  // WIRE inst224
  CONSTX #(.size(11), .\const (1025)) inst79 (.data(inst79_data));
  MP2X #(.size(12)) inst167 (.S(a_mx0), .X0({4'b0000, x_plus_2_[7:0]}), .X1({2'b00, Y_plus_1_[9:0]}), .Y(inst167_y));
  MP2X #(.size(12)) inst168 (.S(a_mx0), .X0(inst177_data), .X1(inst199_y), .Y(inst168_y));
  and inst65 (inst65_out, inst53_ls, inst52_gr);
  REGX #(.size(10), .default_value(0)) inst46 (
    .clk(CLK), .inc(vga_init_inc_y), .data_out(vga_init_y));  // open: ld, cl, dec, data_in
  or inst232 (a_mx1, inst191_out, read_origin_timing, inst229_out, vga_init_write);
  CMPX #(.size(14)) inst44 (.A(vga_init_timer), .B(inst45_data), .eq(vga_init_timer_eq_31));  // open: ls, gr
  CMPX #(.size(10)) inst40 (.A(vga_init_y), .B(inst42_data), .eq(vga_init_y_599));  // open: ls, gr
  and inst25 (RED, sdram_data_out[0], disp_en);
  and inst35 (GREEN, sdram_data_out[1], disp_en);
  and inst39 (BLUE, sdram_data_out[2], disp_en);
  and inst80 (inst80_out, inst65_out, inst66_ls);
  CONSTX #(.size(14), .\const (31)) inst45 (.data(inst45_data));
  CONSTX #(.size(10), .\const (599)) inst42 (.data(inst42_data));
  MP2X #(.size(12)) inst166 (.S(a_mx1), .X0(inst167_y), .X1(inst168_y), .Y(vga_sdram_a));
  or inst96 (char_bounds, inst80_out, inst86_out, inst90_out, inst95_out);
  CONSTX #(.size(11), .\const (2)) inst182 (.data(inst182_data));
  REGX #(.size(11), .default_value(1033)) inst (
    .clk(CLK), .cl(inst24_out), .inc(inst23_out), .data_out(X));  // open: ld, dec, data_in
  CMPX #(.size(11)) inst2 (.A(X), .B(inst4_data), .ls(inst2_ls), .eq(inst2_eq));  // open: gr
  CMPX #(.size(11)) inst6 (.A(X), .B(inst8_data), .gr(inst6_gr));  // open: ls, eq
  CMPX #(.size(10)) inst11 (.A(Y), .B(inst13_data), .gr(inst11_gr));  // open: ls, eq
  CMPX #(.size(11)) inst20 (.A(X), .B(inst17_data), .ls(inst20_ls));  // open: eq, gr
  ADD11 inst181 (.a(X), .b(inst182_data), .cin(1'b0), .r(x_plus_2_));  // open: cout
  CONSTX #(.size(11), .\const (1039)) inst4 (.data(inst4_data));
  and inst24 (inst24_out, inst2_eq, vga_pixel_counter_update);
  CONSTX #(.size(11), .\const (855)) inst8 (.data(inst8_data));
  CONSTX #(.size(10), .\const (636)) inst13 (.data(inst13_data));
  CONSTX #(.size(11), .\const (800)) inst17 (.data(inst17_data));
  and inst23 (inst23_out, inst2_ls, vga_pixel_counter_update);
  REGX #(.size(10), .default_value(665)) inst1 (
    .clk(CLK), .cl(inst21_out), .inc(inst24_out), .data_out(Y));  // open: ld, dec, data_in
  and inst21 (inst21_out, inst24_out, inst3_eq);
  CMPX #(.size(10)) inst3 (.A(Y), .B(inst5_data), .eq(inst3_eq));  // open: ls, gr
  CMPX #(.size(11)) inst7 (.A(X), .B(inst9_data), .ls(inst7_ls));  // open: eq, gr
  CMPX #(.size(10)) inst12 (.A(Y), .B(inst14_data), .ls(inst12_ls));  // open: eq, gr
  CMPX #(.size(10)) inst19 (.A(Y), .B(inst18_data), .ls(inst19_ls));  // open: eq, gr
  CONSTX #(.size(11), .\const (1)) inst184 (.data(inst184_data));
  CONSTX #(.size(10), .\const (665)) inst5 (.data(inst5_data));
  CONSTX #(.size(11), .\const (975)) inst9 (.data(inst9_data));
  CONSTX #(.size(10), .\const (642)) inst14 (.data(inst14_data));
  CONSTX #(.size(10), .\const (600)) inst18 (.data(inst18_data));
  and inst10 (H_SYNC, inst7_ls, inst6_gr);
  and inst15 (V_SYNC, inst12_ls, inst11_gr);
  and inst16 (disp_en, inst19_ls, inst20_ls);
  ADD11 inst183 (.a({1'b0, Y}), .b(inst184_data), .cin(1'b0), .r(Y_plus_1_));  // open: cout
  CMPX #(.size(10)) inst27 (
    .A(Y), .B(inst26_data), .ls(vga_starting_read_commands_y_bounds_bottom), .eq(inst27_eq));  // open: gr
  CMPX #(.size(11)) inst22 (.A(X), .B(inst28_data), .gr(vga_starting_read_commands_x_bounds));  // open: ls, eq
  CMPX #(.size(10)) inst97 (.A(Y), .B(inst98_data), .ls(inst97_ls));  // open: eq, gr
  CONSTX #(.size(10), .\const (600)) inst26 (.data(inst26_data));
  CONSTX #(.size(11), .\const (1033)) inst28 (.data(inst28_data));
  CONSTX #(.size(10), .\const (600)) inst98 (.data(inst98_data));
  or inst38 (vga_ending_read_commands_y_bounds, inst27_eq, vga_starting_read_commands_y_bounds_bottom);
  CMPX #(.size(10)) inst30 (.A(Y), .B(inst37_data), .eq(vga_starting_read_commands_y_bounds_top));  // open: ls, gr
  CMPX #(.size(11)) inst99 (.A(X), .B(inst100_data), .ls(inst99_ls));  // open: eq, gr
  CONSTX #(.size(10), .\const (665)) inst37 (.data(inst37_data));
  CONSTX #(.size(11), .\const (803)) inst100 (.data(inst100_data));
  and inst101 (inst101_out, inst99_ls, inst97_ls);
  or inst36 (vga_starting_read_commands_y_bounds, vga_starting_read_commands_y_bounds_top, vga_starting_read_commands_y_bounds_bottom);
  and inst145 (inst145_out, vga_starting_read_commands_y_bounds, vga_starting_read_commands_x_bounds);
  or inst146 (vga_read_commands_reserved_bounds, inst145_out, inst101_out);
  CMPX #(.size(11)) inst102 (.A(X), .B(inst103_data), .eq(inst102_eq));  // open: ls, gr
  CMPX #(.size(11)) inst105 (.A(X), .B(inst106_data), .eq(inst105_eq));  // open: ls, gr
  CMPX #(.size(11)) inst108 (.A(X), .B(inst109_data), .eq(inst108_eq));  // open: ls, gr
  CMPX #(.size(11)) inst111 (.A(X), .B(inst113_data), .eq(inst111_eq));  // open: ls, gr
  CMPX #(.size(11)) inst114 (.A(X), .B(inst116_data), .eq(inst114_eq));  // open: ls, gr
  CONSTX #(.size(11), .\const (1034)) inst103 (.data(inst103_data));
  CONSTX #(.size(11), .\const (1035)) inst106 (.data(inst106_data));
  CONSTX #(.size(11), .\const (1036)) inst109 (.data(inst109_data));
  CONSTX #(.size(11), .\const (1037)) inst113 (.data(inst113_data));
  CONSTX #(.size(11), .\const (1038)) inst116 (.data(inst116_data));
  and inst104 (ba0_timing_top, inst102_eq, vga_starting_read_commands_y_bounds_top);
  and inst153 (ba0_timing_bottom, inst102_eq, vga_starting_read_commands_y_bounds_bottom);
  and inst107 (ba1_timing_top, inst105_eq, vga_starting_read_commands_y_bounds_top);
  and inst138 (ba1_timing_bottom, inst105_eq, vga_starting_read_commands_y_bounds_bottom);
  and inst110 (ba2_timing_top, inst108_eq, vga_starting_read_commands_y_bounds_top);
  and inst137 (ba2_timing_bottom, inst108_eq, vga_starting_read_commands_y_bounds_bottom);
  and inst112 (ba3_timing_top, inst111_eq, vga_starting_read_commands_y_bounds_top);
  and inst165 (ba3_timing_bottom, inst111_eq, vga_starting_read_commands_y_bounds_bottom);
  and inst115 (read_origin_timing, inst114_eq, vga_starting_read_commands_y_bounds);
  or inst187 (ba0_timing, ba0_timing_top, ba0_timing_bottom);
  or inst188 (ba1_timing, ba1_timing_top, ba1_timing_bottom);
  or inst189 (ba2_timing, ba2_timing_top, ba2_timing_bottom);
  or inst190 (ba3_timing, ba3_timing_top, ba3_timing_bottom);
  CMPX #(.size(10)) inst117 (.A(Y), .B(inst118_data), .ls(inst117_ls));  // open: eq, gr
  CONSTX #(.size(10), .\const (601)) inst118 (.data(inst118_data));
  not inst124 (inst124_out, X[0]);
  and inst123 (inst123_out, X[2], X[1], inst124_out);
  CMPX #(.size(11)) inst142 (.A(X), .B(inst144_data), .eq(inst142_eq));  // open: ls, gr
  CMPX #(.size(11)) inst139 (.A(X), .B(inst141_data), .eq(inst139_eq));  // open: ls, gr
  CMPX #(.size(11)) inst119 (.A(X), .B(inst120_data), .ls(inst119_ls));  // open: eq, gr
  CONSTX #(.size(11), .\const (802)) inst144 (.data(inst144_data));
  CONSTX #(.size(11), .\const (801)) inst141 (.data(inst141_data));
  CONSTX #(.size(11), .\const (791)) inst120 (.data(inst120_data));
  and inst121 (inst121_out, inst119_ls, inst117_ls);
  and inst143 (auto_refresh_timing, inst142_eq, vga_ending_read_commands_y_bounds);
  and inst140 (precharge_all_timing, inst139_eq, vga_ending_read_commands_y_bounds);
  and inst122 (read_add_timing, inst121_out, inst123_out);

  // Notes on the sheet:
  //   ARBITRATOR - veci broj veci prioritet
  //   CHAR WRITE STATE MACHINE - 10 CLK TO COMPLETE
  //   CHAR BOUNDS
  //   STATE 0
  //   STATE 1
  //   STATE 2
  //   STATE 3
endmodule
